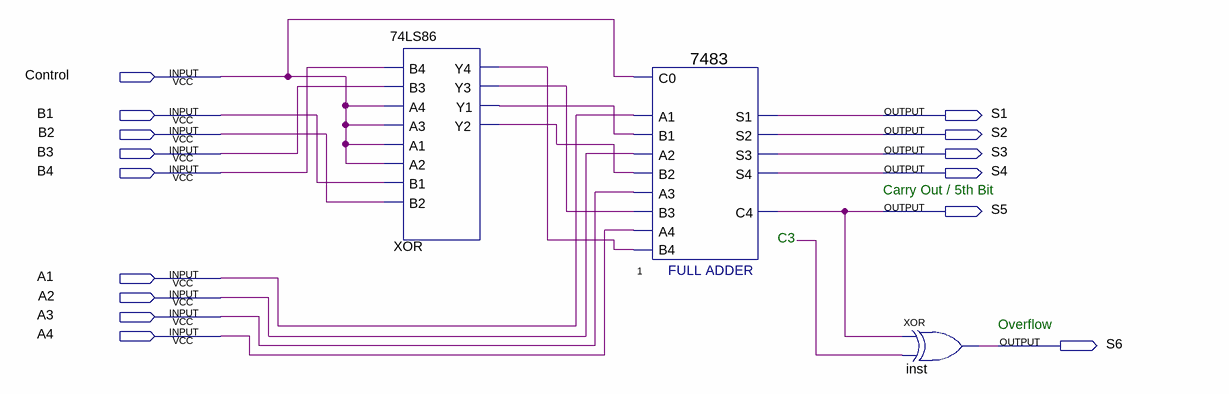
[diagram p0: schematic sheet]
// Quartus schematic ex6_parts_placement.bdf as structural Verilog: 3 symbols, 15 pins
module ex6_parts_placement (
  input  Control,
  input  B1,
  input  B2,
  input  B3,
  input  B4,
  input  A1,
  input  A2,
  input  A3,
  input  A4,
  output S1,
  output S2,
  output S3,
  output S4,
  output S5,
  output S6
);

  wire undriven, XOR_y1, XOR_y2, XOR_y3, XOR_y4;

  \74LS86  XOR (
    .B4(B4), .B3(B3), .A4(Control), .A3(Control), .A1(Control), .A2(Control), .B1(B1), .B2(B2), .Y4(XOR_y4),
    .Y3(XOR_y3), .Y1(XOR_y1), .Y2(XOR_y2));
  \7483  u_1 (
    .B4(XOR_y4), .C0(Control), .A1(A1), .A2(A2), .B1(XOR_y1), .B2(XOR_y2), .A3(A3), .B3(XOR_y3), .A4(A4),
    .S3(S3), .S4(S4), .S2(S2), .C4(S5), .S1(S1));
  xor inst (S6, S5, undriven);

  // Notes on the sheet:
  //   Carry Out / 5th Bit
  //   C3
  //   Overflow
endmodule
